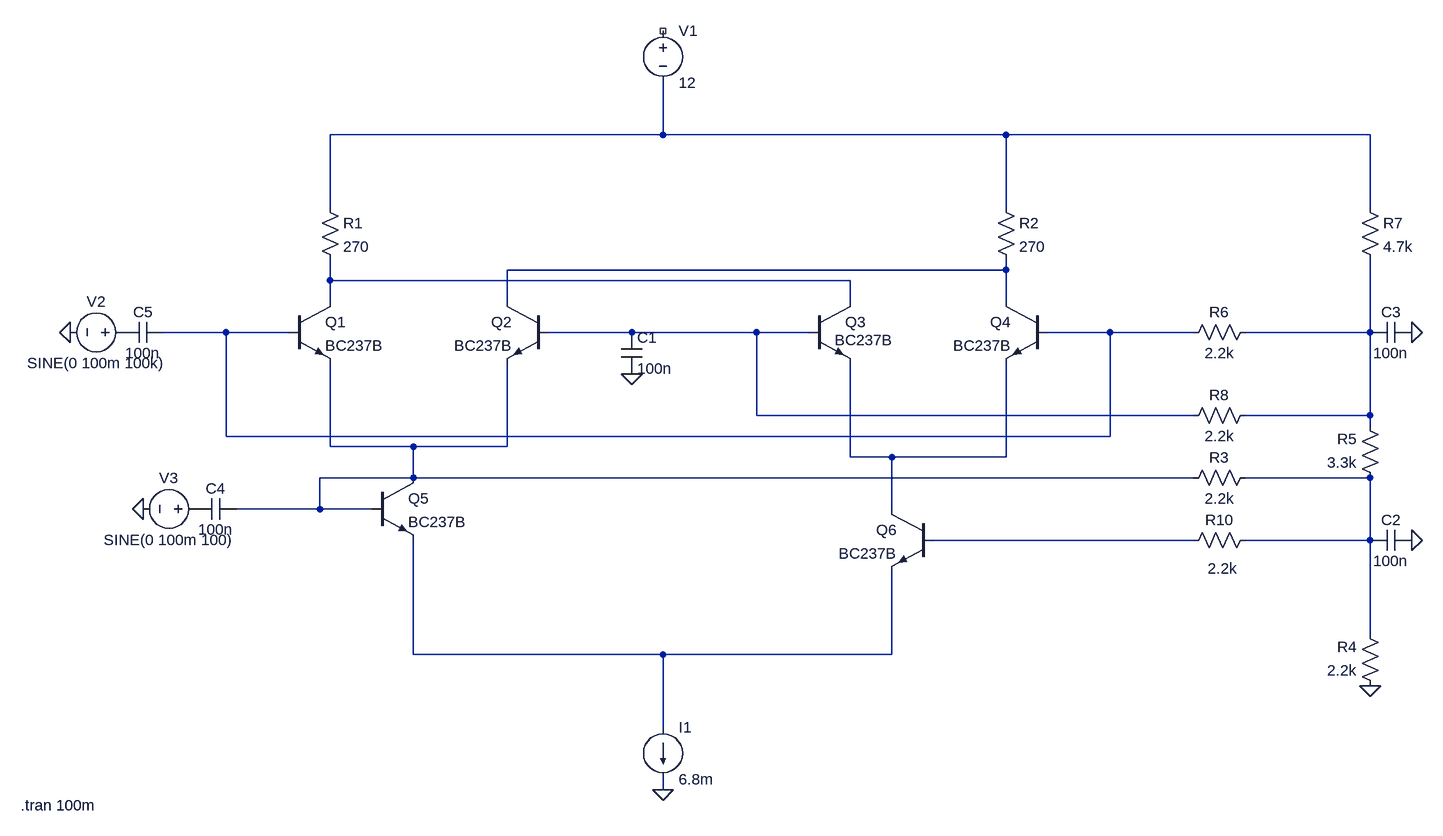
[diagram p0: schematic Gilbert Stock Exchange.asc]
Gilbert Stock Exchange.asc, the LTspice schematic file:
Version 4
SHEET 1 1092 1128
WIRE -96 80 -96 0
WIRE -96 80 -608 80
WIRE 432 80 -96 80
WIRE 992 80 432 80
WIRE -608 192 -608 80
WIRE 432 192 432 80
WIRE 992 192 992 80
WIRE 432 288 432 272
WIRE 432 288 -336 288
WIRE -608 304 -608 272
WIRE 192 304 -608 304
WIRE -608 336 -608 304
WIRE -336 336 -336 288
WIRE 192 336 192 304
WIRE 432 336 432 288
WIRE -768 384 -864 384
WIRE -672 384 -768 384
WIRE -144 384 -272 384
WIRE 48 384 -144 384
WIRE 128 384 48 384
WIRE 592 384 496 384
WIRE 720 384 592 384
WIRE 992 384 992 272
WIRE 992 384 800 384
WIRE 48 512 48 384
WIRE 720 512 48 512
WIRE 992 512 992 384
WIRE 992 512 800 512
WIRE 992 528 992 512
WIRE -768 544 -768 384
WIRE 592 544 592 384
WIRE 592 544 -768 544
WIRE -608 560 -608 432
WIRE -480 560 -608 560
WIRE -336 560 -336 432
WIRE -336 560 -480 560
WIRE 192 576 192 432
WIRE 256 576 192 576
WIRE 432 576 432 432
WIRE 432 576 256 576
WIRE -480 608 -480 560
WIRE -480 608 -624 608
WIRE 720 608 -480 608
WIRE 992 608 800 608
WIRE -624 656 -624 608
WIRE -624 656 -752 656
WIRE -544 656 -624 656
WIRE 256 656 256 576
WIRE 720 704 320 704
WIRE 992 704 992 608
WIRE 992 704 800 704
WIRE 992 848 992 704
WIRE -480 880 -480 704
WIRE -96 880 -480 880
WIRE 256 880 256 752
WIRE 256 880 -96 880
WIRE -96 992 -96 880
WIRE -96 1088 -96 1072
FLAG -1008 384 0
FLAG -896 656 0
FLAG -96 1088 0
FLAG 992 928 0
FLAG -144 448 0
FLAG 1056 384 0
FLAG 1056 704 0
SYMBOL voltage -96 -96 R0
WINDOW 123 0 0 Left 0
WINDOW 39 0 0 Left 0
SYMATTR InstName V1
SYMATTR Value 12
SYMBOL res -624 176 R0
SYMATTR InstName R1
SYMATTR Value 270
SYMBOL res 416 176 R0
SYMATTR InstName R2
SYMATTR Value 270
SYMBOL res 816 592 R90
WINDOW 0 0 56 VBottom 2
WINDOW 3 32 56 VTop 2
SYMATTR InstName R3
SYMATTR Value 2.2k
SYMBOL res 1008 944 R180
WINDOW 0 36 76 Left 2
WINDOW 3 36 40 Left 2
SYMATTR InstName R4
SYMATTR Value 2.2k
SYMBOL res 1008 624 R180
WINDOW 0 36 76 Left 2
WINDOW 3 36 40 Left 2
SYMATTR InstName R5
SYMATTR Value 3.3k
SYMBOL res 704 400 R270
WINDOW 0 32 56 VTop 2
WINDOW 3 0 56 VBottom 2
SYMATTR InstName R6
SYMATTR Value 2.2k
SYMBOL res 976 176 R0
SYMATTR InstName R7
SYMATTR Value 4.7k
SYMBOL res 816 496 R90
WINDOW 0 0 56 VBottom 2
WINDOW 3 32 56 VTop 2
SYMATTR InstName R8
SYMATTR Value 2.2k
SYMBOL res 816 688 R90
WINDOW 0 0 56 VBottom 2
WINDOW 3 44 51 VTop 2
SYMATTR InstName R10
SYMATTR Value 2.2k
SYMBOL npn -672 336 R0
SYMATTR InstName Q1
SYMATTR Value BC237B
SYMBOL npn -272 336 M0
SYMATTR InstName Q2
SYMATTR Value BC237B
SYMBOL npn 128 336 R0
WINDOW 3 40 60 Left 2
SYMATTR InstName Q3
SYMATTR Value BC237B
SYMBOL npn 496 336 M0
SYMATTR InstName Q4
SYMATTR Value BC237B
SYMBOL npn -544 608 R0
SYMATTR InstName Q5
SYMATTR Value BC237B
SYMBOL npn 320 656 M0
SYMATTR InstName Q6
SYMATTR Value BC237B
SYMBOL cap -160 384 R0
SYMATTR InstName C1
SYMATTR Value 100n
SYMBOL cap 1056 688 R90
WINDOW 0 0 32 VBottom 2
WINDOW 3 32 32 VTop 2
SYMATTR InstName C2
SYMATTR Value 100n
SYMBOL cap 1056 368 R90
WINDOW 0 0 32 VBottom 2
WINDOW 3 32 32 VTop 2
SYMATTR InstName C3
SYMATTR Value 100n
SYMBOL cap -752 640 R90
WINDOW 0 0 32 VBottom 2
WINDOW 3 32 32 VTop 2
SYMATTR InstName C4
SYMATTR Value 100n
SYMBOL cap -864 368 R90
WINDOW 0 0 32 VBottom 2
WINDOW 3 32 32 VTop 2
SYMATTR InstName C5
SYMATTR Value 100n
SYMBOL voltage -912 384 R90
WINDOW 0 -32 56 VBottom 2
WINDOW 3 32 56 VTop 2
WINDOW 123 0 0 Left 0
WINDOW 39 0 0 Left 0
SYMATTR InstName V2
SYMATTR Value SINE(0 100m 100k)
SYMBOL voltage -800 656 R90
WINDOW 0 -32 56 VBottom 2
WINDOW 3 32 56 VTop 2
WINDOW 123 0 0 Left 0
WINDOW 39 0 0 Left 0
SYMATTR InstName V3
SYMATTR Value SINE(0 100m 100)
SYMBOL current -96 992 R0
WINDOW 123 0 0 Left 0
WINDOW 39 0 0 Left 0
SYMATTR InstName I1
SYMATTR Value 6.8m
TEXT -1084 1112 Left 2 !.tran 100m

The netlist it stands for:
* Gilbert Stock Exchange.asc
V1 NC_01 N001 12
R1 N001 N003 270
R2 N001 N002 270
R3 N009 N007 2.2k
R4 0 N009 2.2k
R5 N009 N006 3.3k
R6 N004 N006 2.2k
R7 N001 N006 4.7k
R8 N006 N005 2.2k
R10 N009 N010 2.2k
Q1 N003 N004 N007 0 BC237B
Q2 N002 N005 N007 0 BC237B
Q3 N003 N005 N008 0 BC237B
Q4 N002 N004 N008 0 BC237B
Q5 N007 N007 N011 0 BC237B
Q6 N008 N010 N011 0 BC237B
C1 N005 0 100n
C2 0 N009 100n
C3 0 N006 100n
C4 N007 P001 100n
C5 N004 P002 100n
V2 P002 0 SINE(0 100m 100k)
V3 P001 0 SINE(0 100m 100)
I1 N011 0 6.8m
.model NPN NPN
.model PNP PNP
.lib standard.bjt
.tran 100m
.backanno
.end